# EAGLE design module (EAGLE 7.7.0)
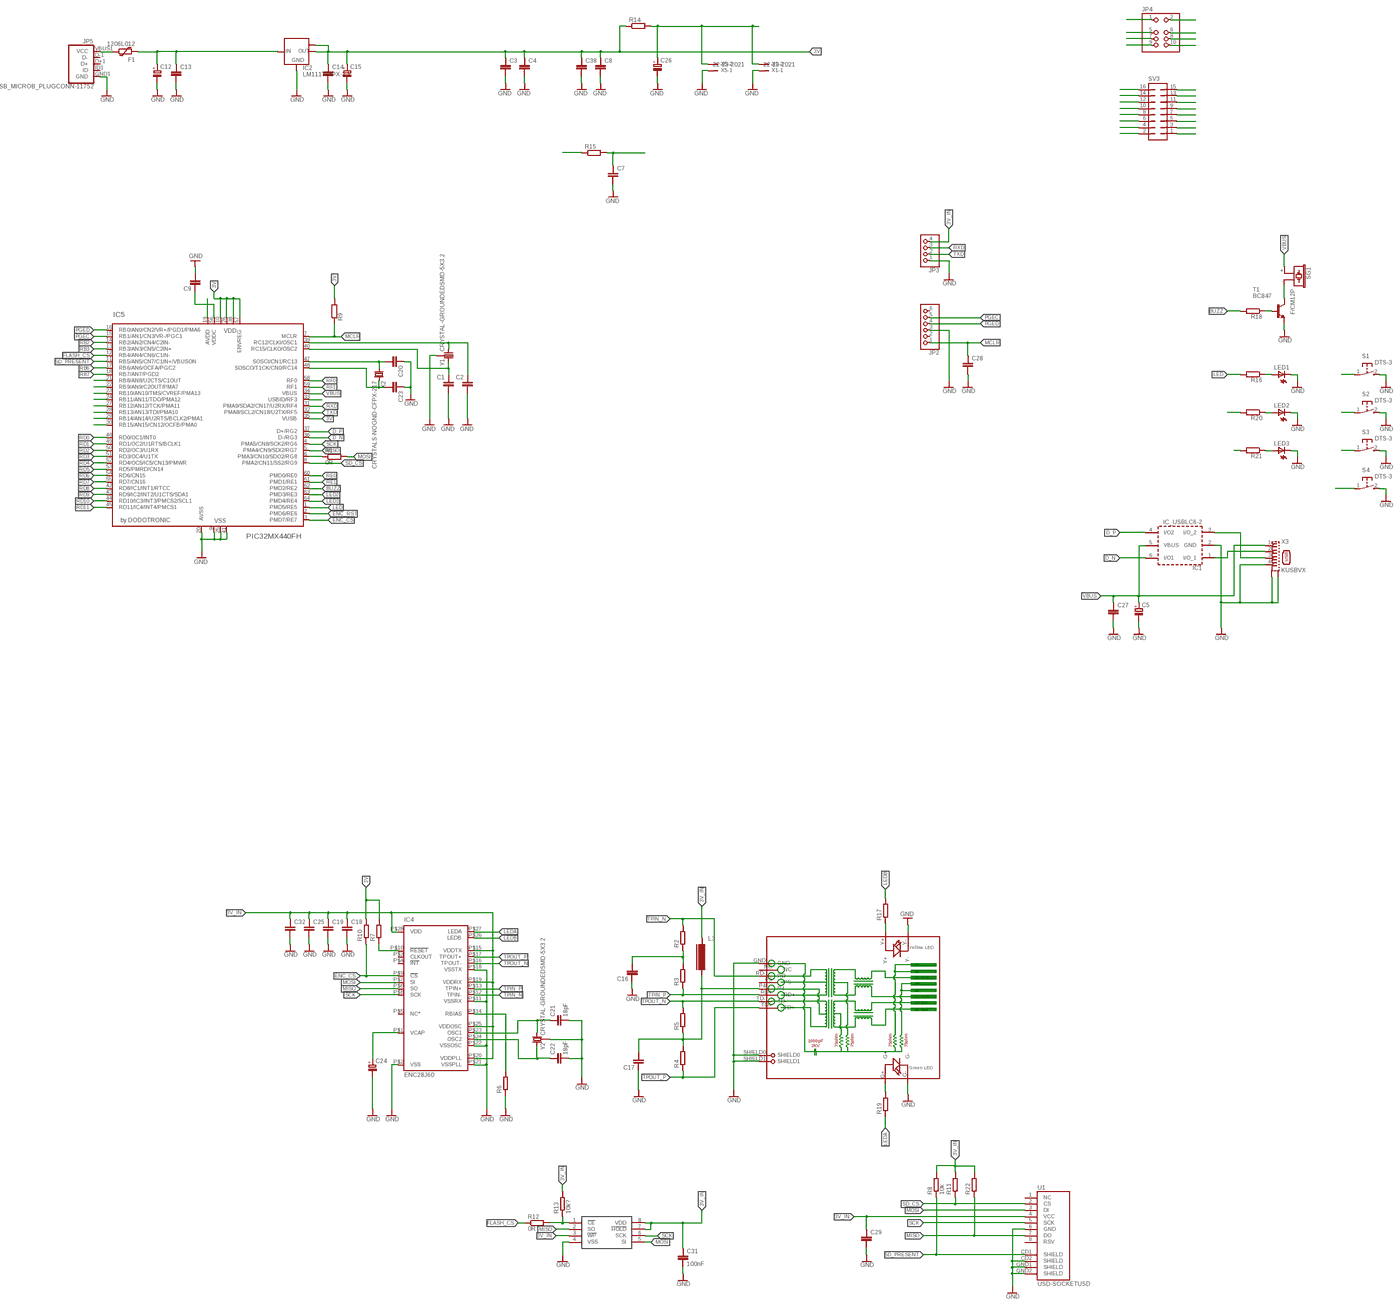
[diagram p0: schematic, sheet 1, overview]
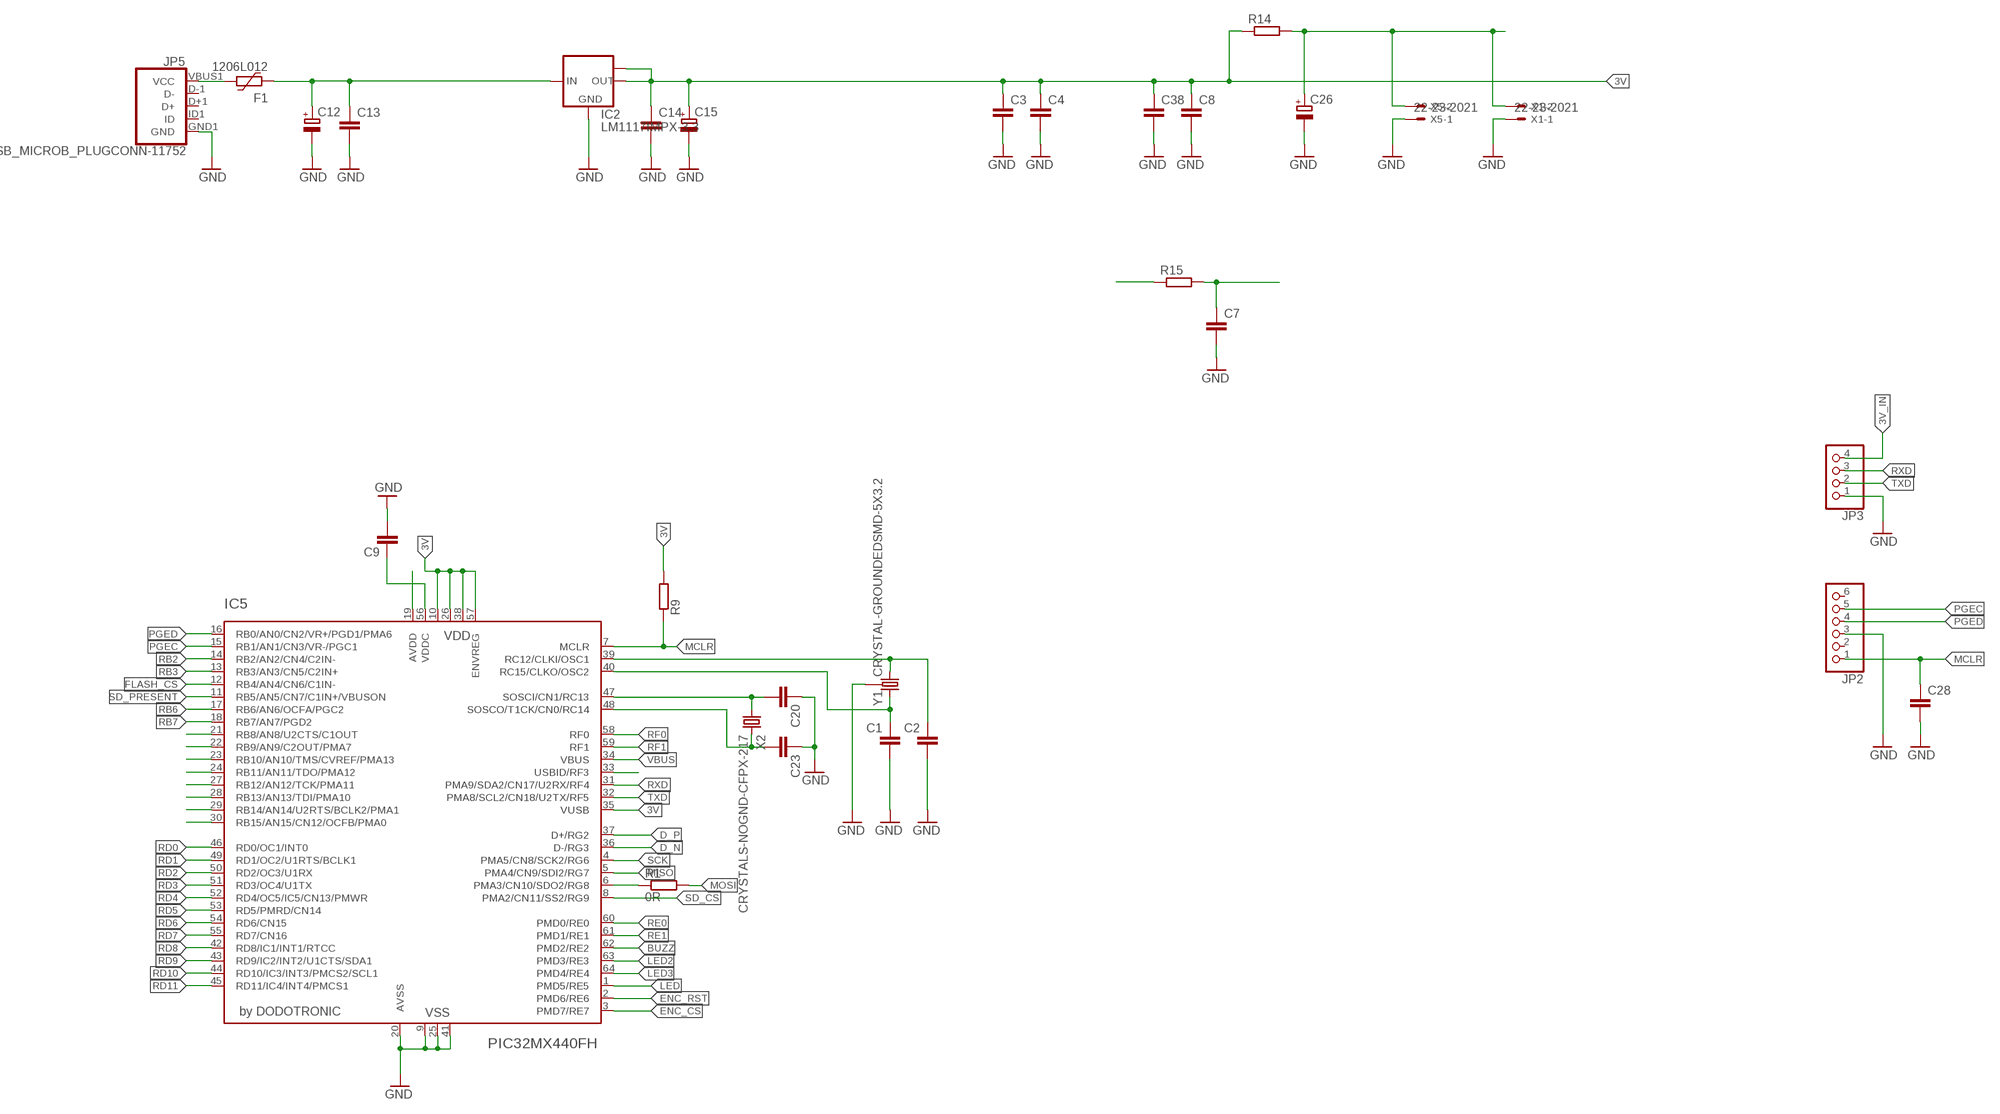
[diagram p1: schematic, sheet 1, part 1 of 4]
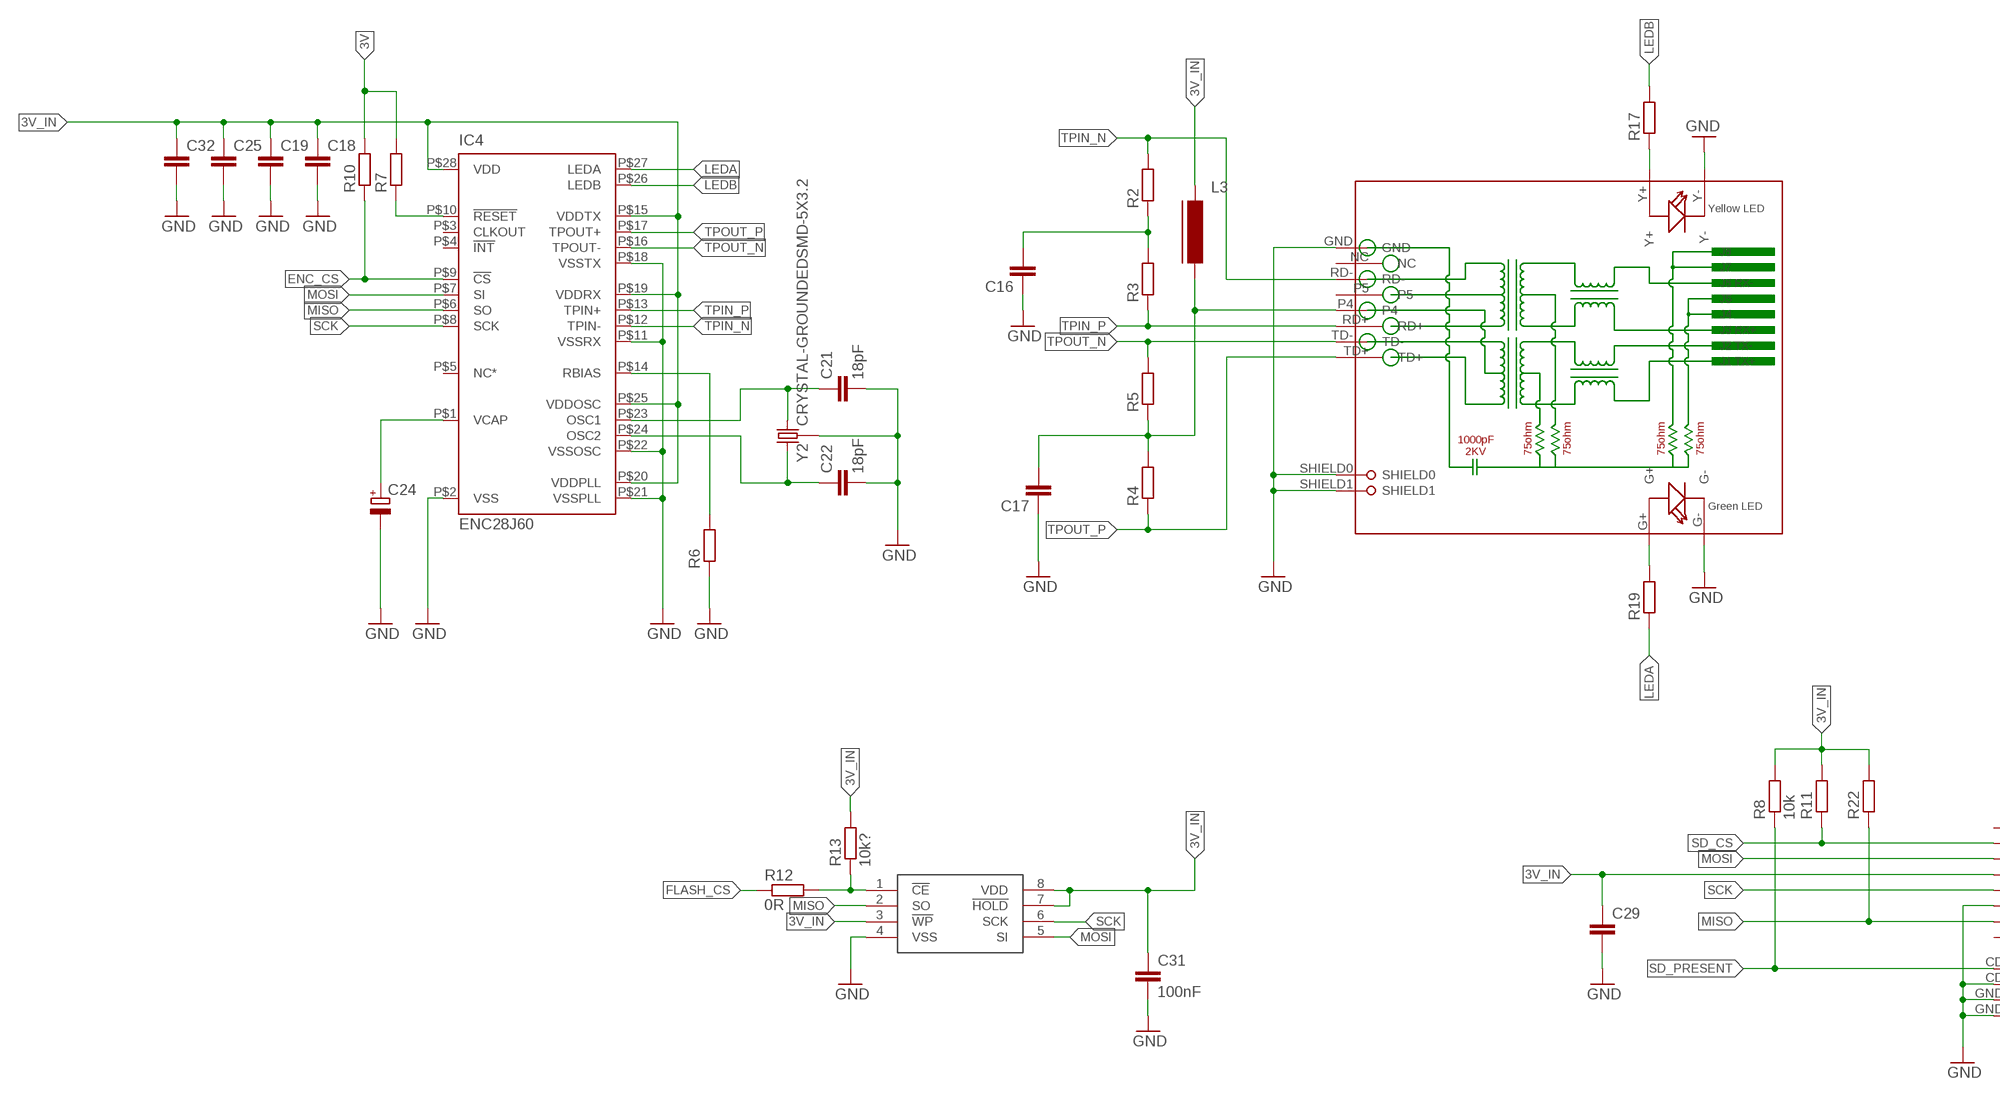
[diagram p2: schematic, sheet 1, part 2 of 4]
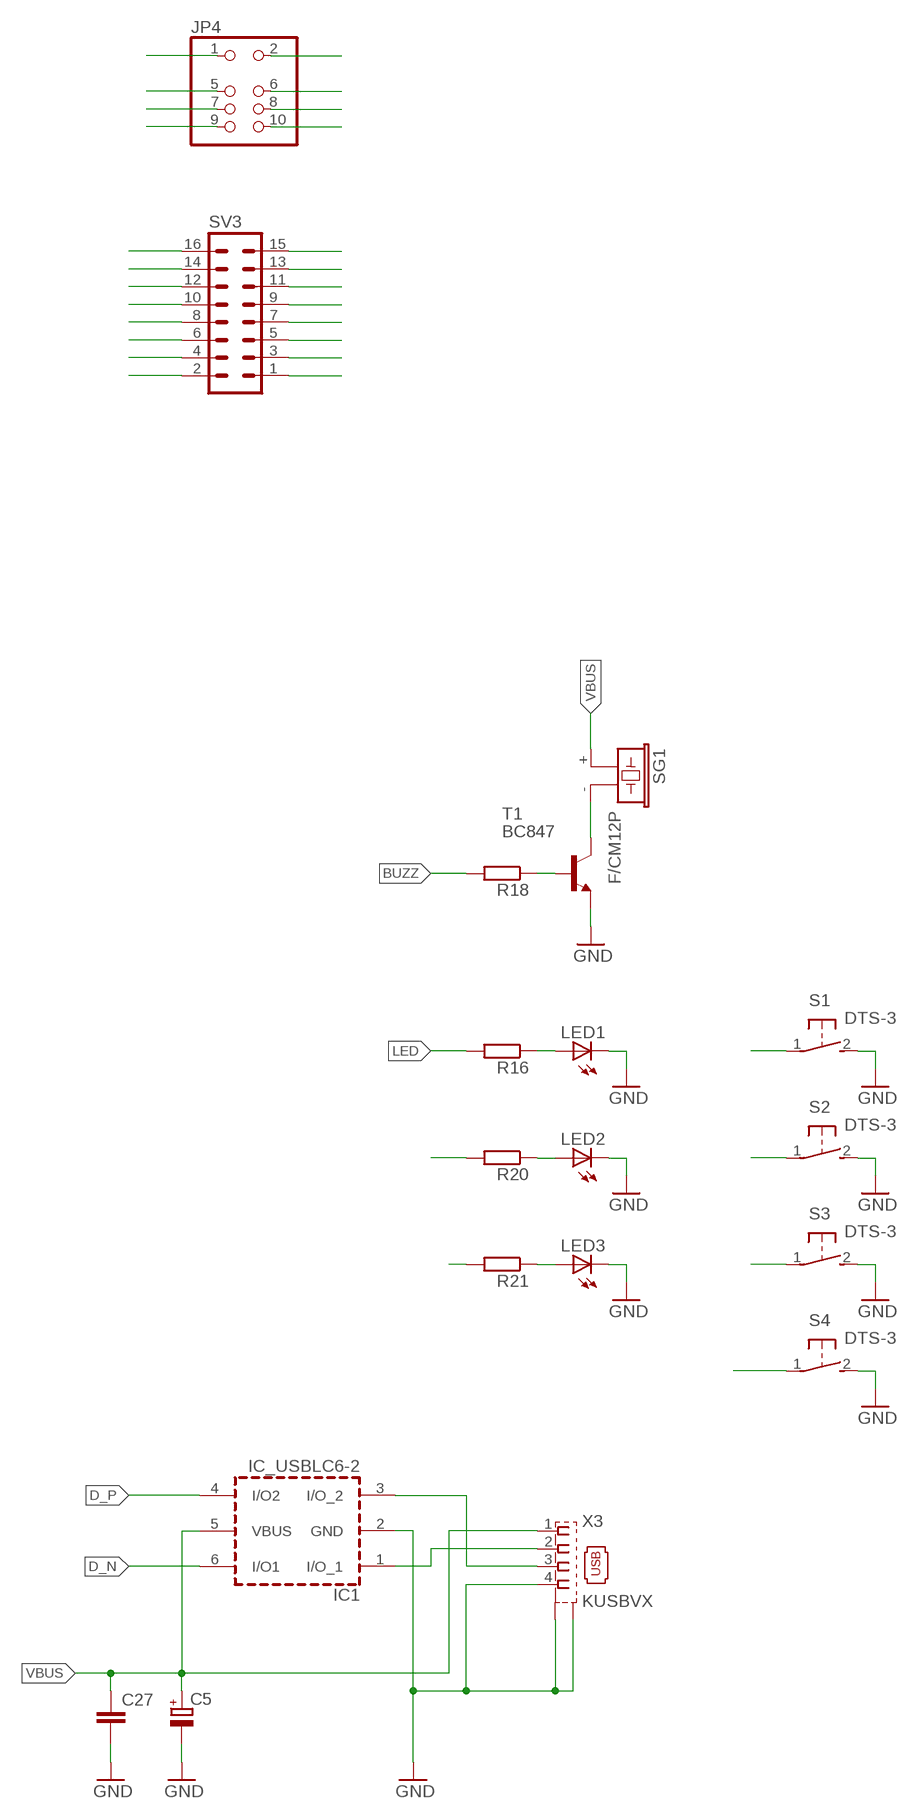
[diagram p3: schematic, sheet 1, part 3 of 4]
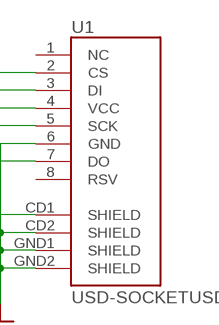
[diagram p4: schematic, sheet 1, part 4 of 4]

## Parts
C1  C-EUC0603  [C0603]
C2  C-EUC0603  [C0603]
C3  C-EUC0402  [C0402]
C4  C-EUC0402  [C0402]
C5  CPOL-EUSMCA  [SMC_A]
C7  C-EUC0402  [C0402]
C8  C-EUC0402  [C0402]
C9  C-EUC0603  [C0603]
C12  CPOL-EUSMCB  [SMC_B]
C13  C-EUC0603  [C0603]
C14  C-EUC0603  [C0603]
C15  CPOL-EUSMCB  [SMC_B]
C16  C-EUC0603  [C0603]
C17  C-EUC0603  [C0603]
C18  C-EUC0402  [C0402]
C19  C-EUC0603  [C0603]
C20  C-EUC0603  [C0603]
C21  18pF  C-EUC0603  [C0603]
C22  18pF  C-EUC0603  [C0603]
C23  C-EUC0603  [C0603]
C24  CPOL-EUSMCA  [SMC_A]
C25  C-EUC0603  [C0603]
C26  CPOL-EUSMCA  [SMC_A]
C27  C-EUC0603  [C0603]
C28  C-EUC0603  [C0603]
C29  C-EUC0603  [C0603]
C31  100nF  C-EUC0603  [C0603]
C32  C-EUC0402  [C0402]
C38  C-EUC0603  [C0603]
F1  1206L012  [1206L]
IC1  IC_USBLC6-2  [SOT-23-6L]
IC2  LM1117IMPX-3.3  [SOT223]
IC4  ENC28J60  [TSSOP28W]
IC5  PIC32MX440FH  [TQFP64-10X10]
JP2  PINHD-1X6  [1X06]
JP3  PINHD-1X4  [1X04]
JP4  PINHD-2X5  [2X05]
JP5  USB_MICROB_PLUGCONN-11752  [USB-B-MICRO-SMD_V03]
L3  FERRITE-0805  [FB805]
LED1  LED3MM  [LED3MM]
LED2  LED3MM  [LED3MM]
LED3  LED3MM  [LED3MM]
R1  0R  R-EU_R0603  [R0603]
R2  R-EU_R0603  [R0603]
R3  R-EU_R0603  [R0603]
R4  R-EU_R0603  [R0603]
R5  R-EU_R0603  [R0603]
R6  R-EU_R0805  [R0805]
R7  R-EU_R0402  [R0402]
R8  10k  R-EU_R0603  [R0603]
R9  R-EU_R0603  [R0603]
R10  R-EU_R0603  [R0603]
R11  R-EU_R0603  [R0603]
R12  0R  R-EU_R0603  [R0603]
R13  10k?  R-EU_R0603  [R0603]
R14  R-EU_R2010  [R2010]
R15  R-EU_R0805  [R0805]
R16  R-EU_R0603  [R0603]
R17  R-EU_R1206  [R1206]
R18  R-EU_R0603  [R0603]
R19  R-EU_R1206  [R1206]
R20  R-EU_R0603  [R0603]
R21  R-EU_R0603  [R0603]
R22  R-EU_R0603  [R0603]
RJ1  HR911105A  [HR911105A]
S1  DTS-3  [DTS-3]
S2  DTS-3  [DTS-3]
S3  DTS-3  [DTS-3]
S4  DTS-3  [DTS-3]
SG1  F/CM12P  [F/CM12P]
SV3  ML16L  [ML16L]
T1  BC847  [SOT23]
U1  USD-SOCKETUSD  [USD-SOCKET-PP]
U$2  SST25VF016BSO8M  [SO-08M]
X1  22-23-2021  [22-23-2021]
X2  CRYSTALS-NOGND-CFPX-217  [3.2X1.5-2-PAD]
X3  KUSBVX  [KUSBVX]
X5  22-23-2021  [22-23-2021]
Y1  CRYSTAL-GROUNDEDSMD-5X3.2  [CRYSTAL-SMD-5X3.2-4PAD]
Y2  CRYSTAL-GROUNDEDSMD-5X3.2  [CRYSTAL-SMD-5X3.2-4PAD]

## Nets
3V: C3.1 C4.1 C8.1 C14.1 C15.+ C38.1 IC2.2(OUT) IC2.TAB(OUT1) IC5.10(VDD) IC5.26(VDD) IC5.35(VUSB) IC5.38(VDD) IC5.57(ENVREG) R7.2 R9.2 R10.2 R14.1
3V_IN: C18.1 C19.1 C25.1 C26.+ C29.1 C31.1 C32.1 IC4.P$15(VDDTX) IC4.P$19(VDDRX) IC4.P$20(VDDPLL) IC4.P$25(VDDOSC) IC4.P$28(VDD) JP3.4 L3.1 R8.2 R11.2 R13.2 R14.2 R15.1 R22.2 U1.4(VCC) U$2.3(!WP) U$2.7(!HOLD) U$2.8(VDD) X1.2 X5.2
AV_3V: C7.1 IC5.19(AVDD) R15.2
BUZZ: IC5.62(PMD2/RE2) R18.2
CE1: R12.2 R13.1 U$2.1(!CE)
D2_N: IC1.1(I/O_1) X3.2
D2_P: IC1.3(I/O_2) X3.3
D_N: IC1.6(I/O1) IC5.36(D-/RG3)
D_P: IC1.4(I/O2) IC5.37(D+/RG2)
ENC_CS: IC4.P$9(!CS) IC5.3(PMD7/RE7) R10.1
ENC_RST: IC4.P$10(!RESET) IC5.2(PMD6/RE6) R7.1
FLASH_CS: IC5.12(RB4/AN4/CN6/C1IN-) R12.1
GND: C1.2 C2.2 C3.2 C4.2 C5.- C7.2 C8.2 C9.2 C12.- C13.2 C14.2 C15.- C16.1 C17.1 C18.2 C19.2 C20.1 C21.2 C22.2 C23.1 C24.- C25.2 C26.- C27.2 C28.2 C29.2 C31.2 C32.2 C38.2 IC1.2(GND) IC2.1(GND) IC4.P$2(VSS) IC4.P$11(VSSRX) IC4.P$18(VSSTX) IC4.P$21(VSSPLL) IC4.P$22(VSSOSC) IC5.9(VSS) IC5.20(AVSS) IC5.25(VSS) IC5.41(VSS) JP2.3 JP3.1 JP5.GND1(GND) LED1.K(C) LED2.K(C) LED3.K(C) R6.1 RJ1.G- RJ1.GND RJ1.SHIELD0 RJ1.SHIELD1 RJ1.Y- S1.2 S2.2 S3.2 S4.2 T1.2(E) U1.6(GND) U1.CD2(SHIELD) U1.GND1(SHIELD) U1.GND2(SHIELD) U$2.4(VSS) X1.1 X3.4 X3.M1(S1) X3.M2(S2) X5.1 Y1.2 Y1.4 Y2.2 Y2.4
LED: IC5.1(PMD5/RE5) R16.2
LED2: IC5.63(PMD3/RE3) R20.2
LED3: IC5.64(PMD4/RE4) R21.2
LEDA: IC4.P$27(LEDA) R19.1
LEDB: IC4.P$26(LEDB) R17.2
MCLR: C28.1 IC5.7(MCLR) JP2.1 R9.1
MISO: IC4.P$6(SO) IC5.5(PMA4/CN9/SDI2/RG7) R22.1 U1.7(DO) U$2.2(SO)
MOSI: IC4.P$7(SI) R1.2 U1.3(DI) U$2.5(SI)
N$1: SG1.- T1.3(C)
N$2: C16.2 R2.1 R3.2
N$3: R18.1 T1.1(B)
N$4: LED1.A R16.1
N$5: IC5.6(PMA3/CN10/SDO2/RG8) R1.1
N$6: C17.2 L3.2 R4.2 R5.1 RJ1.P4
N$7: LED2.A R20.1
N$12: IC4.P$14(RBIAS) R6.2
N$13: LED3.A R21.1
N$14: IC5.21(RB8/AN8/U2CTS/C1OUT) JP4.9
N$15: IC5.22(RB9/AN9/C2OUT/PMA7) JP4.10
N$16: IC5.23(RB10/AN10/TMS/CVREF/PMA13) JP4.7
N$17: F1.1 JP5.VBUS1(VCC)
N$18: IC5.24(RB11/AN11/TDO/PMA12) JP4.8
N$19: IC5.27(RB12/AN12/TCK/PMA11)
N$20: IC5.28(RB13/AN13/TDI/PMA10) JP4.5
N$21: IC5.29(RB14/AN14/U2RTS/BCLK2/PMA1) JP4.6
N$22: C21.1 IC4.P$23(OSC1) Y2.1
N$23: C22.1 IC4.P$24(OSC2) Y2.3
N$24: IC5.30(RB15/AN15/CN12/OCFB/PMA0) JP4.1
N$25: IC5.33(USBID/RF3) JP4.2
N$29: C24.+ IC4.P$1(VCAP)
N$30: R17.1 RJ1.Y+
N$31: R19.2 RJ1.G+
OSC1: C2.1 IC5.39(RC12/CLKI/OSC1) Y1.1
OSC2: C1.1 IC5.40(RC15/CLKO/OSC2) Y1.3
PGEC: IC5.15(RB1/AN1/CN3/VR-/PGC1) JP2.5
PGED: IC5.16(RB0/AN0/CN2/VR+/PGD1/PMA6) JP2.4
RB2: IC5.14(RB2/AN2/CN4/C2IN-) S2.1
RB3: IC5.13(RB3/AN3/CN5/C2IN+) S1.1
RB6: IC5.17(RB6/AN6/OCFA/PGC2) S3.1
RB7: IC5.18(RB7/AN7/PGD2) S4.1
RD0: IC5.46(RD0/OC1/INT0) SV3.6
RD1: IC5.49(RD1/OC2/U1RTS/BCLK1) SV3.5
RD2: IC5.50(RD2/OC3/U1RX) SV3.8
RD3: IC5.51(RD3/OC4/U1TX) SV3.7
RD4: IC5.52(RD4/OC5/IC5/CN13/PMWR) SV3.10
RD5: IC5.53(RD5/PMRD/CN14) SV3.9
RD6: IC5.54(RD6/CN15) SV3.12
RD7: IC5.55(RD7/CN16) SV3.11
RD8: IC5.42(RD8/IC1/INT1/RTCC) SV3.2
RD9: IC5.43(RD9/IC2/INT2/U1CTS/SDA1) SV3.1
RD10: IC5.44(RD10/IC3/INT3/PMCS2/SCL1) SV3.4
RD11: IC5.45(RD11/IC4/INT4/PMCS1) SV3.3
RE0: IC5.60(PMD0/RE0) SV3.16
RE1: IC5.61(PMD1/RE1) SV3.15
RF0: IC5.58(RF0) SV3.14
RF1: IC5.59(RF1) SV3.13
RXD: IC5.31(PMA9/SDA2/CN17/U2RX/RF4) JP3.3
SCK: IC4.P$8(SCK) IC5.4(PMA5/CN8/SCK2/RG6) U1.5(SCK) U$2.6(SCK)
SD_CS: IC5.8(PMA2/CN11/SS2/RG9) R11.1 U1.2(CS)
SD_PRESENT: IC5.11(RB5/AN5/CN7/C1IN+/VBUSON) R8.1 U1.CD1(SHIELD)
SOSCI: C20.2 IC5.47(SOSCI/CN1/RC13) X2.1
SOSCO: C23.2 IC5.48(SOSCO/T1CK/CN0/RC14) X2.2
TPIN_N: IC4.P$12(TPIN-) R2.2 RJ1.RD-
TPIN_P: IC4.P$13(TPIN+) R3.1 RJ1.RD+
TPOUT_N: IC4.P$16(TPOUT-) R5.2 RJ1.TD-
TPOUT_P: IC4.P$17(TPOUT+) R4.1 RJ1.TD+
TXD: IC5.32(PMA8/SCL2/CN18/U2TX/RF5) JP3.2
VBUS: C5.+ C12.+ C13.1 C27.1 F1.2 IC1.5(VBUS) IC2.3(IN) IC5.34(VBUS) SG1.+ X3.1
VCAP: C9.1 IC5.56(VDDC)
Unconnected: IC4.P$3(CLKOUT) IC4.P$4(!INT) IC4.P$5(NC*) JP2.2 JP2.6 JP5.D+1(D+) JP5.D-1(D-) JP5.ID1(ID) RJ1.NC RJ1.P5 U1.1(NC) U1.8(RSV)

## Library data of the parts
C1-C4 C7-C9 C13 C14 C16-C23 C25 C27-C29 C31 C32 C38 = rcl:C-EU: CAPACITOR, European symbol
C5 C12 C15 C24 C26 = rcl:CPOL-EU: POLARIZED CAPACITOR, European symbol
F1 = polyfuse-smd_10:?: Polyfuse Resettable PTC Source: http://www.littelfuse.com/products/resettable-ptcs.aspx; MF: Littelfuse; MPN: 1206L012; OC_FARNELL: 1596988; OC_NEWARK: 05M2298
IC1 = dp_devices:IC_USBLC6-2
IC2 = lm1117:LM1117IMPX-*
IC4 = microchip:ENC28J60: Stand-Alone Ethernet Controller with SPI Interface Source: http://ww1.microchip.com/downloads/en/DeviceDoc/39662c.pdf
IC5 = DodoMicroR3:PIC32MX440F*H: Microchip PIC32 USB
JP2 = pinhead:PINHD-1X6: PIN HEADER
JP3 = pinhead:PINHD-1X4: PIN HEADER
JP4 = mw:PINHD-2X5: PIN HEADER
JP5 = SparkFun-Connectors:USB_MICROB_PLUG: USB Micro-B connectors Some male, some female. Watch your step!; PROD_ID: CONN-11752
L3 = dp_devices:FERRITE: Ferrite bead in various packages
LED1-LED3 = led:LED: LED OSRAM: - CHIPLED LG R971, LG N971, LY N971, LG Q971, LY Q971, LO R971, LY R971 LH N974, LH R974 LS Q976, LO Q976, LY Q976 LO Q996 - Hyper CHIPLED LW Q18S LB Q993, LB Q99A, LB R99A - SideLED LS A670, LO A670, LY A670, LG A670, LP A670 LB A673, LV A673, LT A673, LW A673 LH A674 LY A675 LS A676, LA A676, LO A676, LY A676, LW A676 LS A679, LY A679, LG A679 - Hyper Micro SIDELED® LS Y876, LA Y876, LO Y876, LY Y876 LT Y87S - SmartLED LW L88C, LW L88S LB L89C, LB L89S, LG L890 LS L89K, LO L89K, LY L89K LS L896, LA L896, LO L896, LY L896 - TOPLED LS T670, LO T670, LY T670, LG T670, LP T670 LSG T670, LSP T670, LSY T670, LOP T670, LYG T670 LG T671, LOG T671, LSG T671 LB T673, LV T673, LT T673, LW T673 LH T674 LS T676, LA T676, LO T676, LY T676, LB T676, LH T676, LSB T676, LW T676 LB T67C, LV T67C, LT T67C, LS T67K, LO T67K, LY T67K, LW E67C LS E67B, LA E67B, LO E67B, LY E67B, LB E67C, LV E67C, LT E67C LW T67C LS T679, LY T679, LG T679 LS T770, LO T770, LY T770, LG T770, LP T770 LB T773, LV T773, LT T773, LW T773 LH T774 LS E675, LA E675, LY E675, LS T675 LS T776, LA T776, LO T776, LY T776, LB T776 LHGB T686 LT T68C, LB T68C - Hyper Mini TOPLED® LB M676 - Mini TOPLED Santana® LG M470 LS M47K, LO M47K, LY M47K Source: http://www.osram.convergy.de LUXEON: - LUMILED® LXK2-PW12-R00, LXK2-PW12-S00, LXK2-PW14-U00, LXK2-PW14-V00 LXK2-PM12-R00, LXK2-PM12-S00, LXK2-PM14-U00 LXK2-PE12-Q00, LXK2-PE12-R00, LXK2-PE12-S00, LXK2-PE14-T00, LXK2-PE14-U00 LXK2-PB12-K00, LXK2-PB12-L00, LXK2-PB12-M00, LXK2-PB14-N00, LXK2-PB14-P00, LXK2-PB14-Q00 LXK2-PR12-L00, LXK2-PR12-M00, LXK2-PR14-Q00, LXK2-PR14-R00 LXK2-PD12-Q00, LXK2-PD12-R00, LXK2-PD12-S00 LXK2-PH12-R00, LXK2-PH12-S00 LXK2-PL12-P00, LXK2-PL12-Q00, LXK2-PL12-R00 Source: www.luxeon.com KINGBRIGHT: KA-3528ASYC Source: www.kingbright.com
R1-R22 = rcl:R-EU_: RESISTOR, European symbol
RJ1 = hanrun:HR911105A
S1-S4 = switch-tact:DTS-3
SG1 = buzzer:F/CM12P: BUZZER Source: Buerklin; OC_FARNELL: unknown; OC_NEWARK: unknown
SV3 = con-harting-ml:ML16: HARTING; OC_FARNELL: unknown; OC_NEWARK: unknown
T1 = transistor:BC847: NPN TRANSISTOR
U1 = SparkFun-Connectors:USD-SOCKET: microSD Socket Push-push type uSD socket. Schematic element and footprint production proven. Spark Fun Electronics SKU : PRT-00127. tDoc lines correctly indicate media card edge positions when inserting (unlocked, locked, depressed).
U$2 = mw:SST25VF016B
X1 X5 = con-molex:22-23-2021: .100" (2.54mm) Center Header - 2 Pin; MF: MOLEX; MPN: 22-23-2021; OC_FARNELL: 1462926; OC_NEWARK: 25C3832
X2 = IQD-Frequency-Products:CRYSTALS-NOGND: CRYSTALS CAN NOT GROUNDED
X3 = con-kycon:KUSBVX: Vertical,Top Entry Universal Serial Bus Connector KUSBVX Series Source: KYCON Sibalco USB vertical socket KUSBV.pdf
Y1 Y2 = SparkFun-Clocks:CRYSTAL-GROUNDED: Crystals w/ Ground Pin (Generic) These are passive quartz crystals, which can be used as a clock source for a microcontroller. Crystal's are usually two-terminal devices. A third terminal may be optionally connected to ground, as recommended by the manufaturer.

## Board
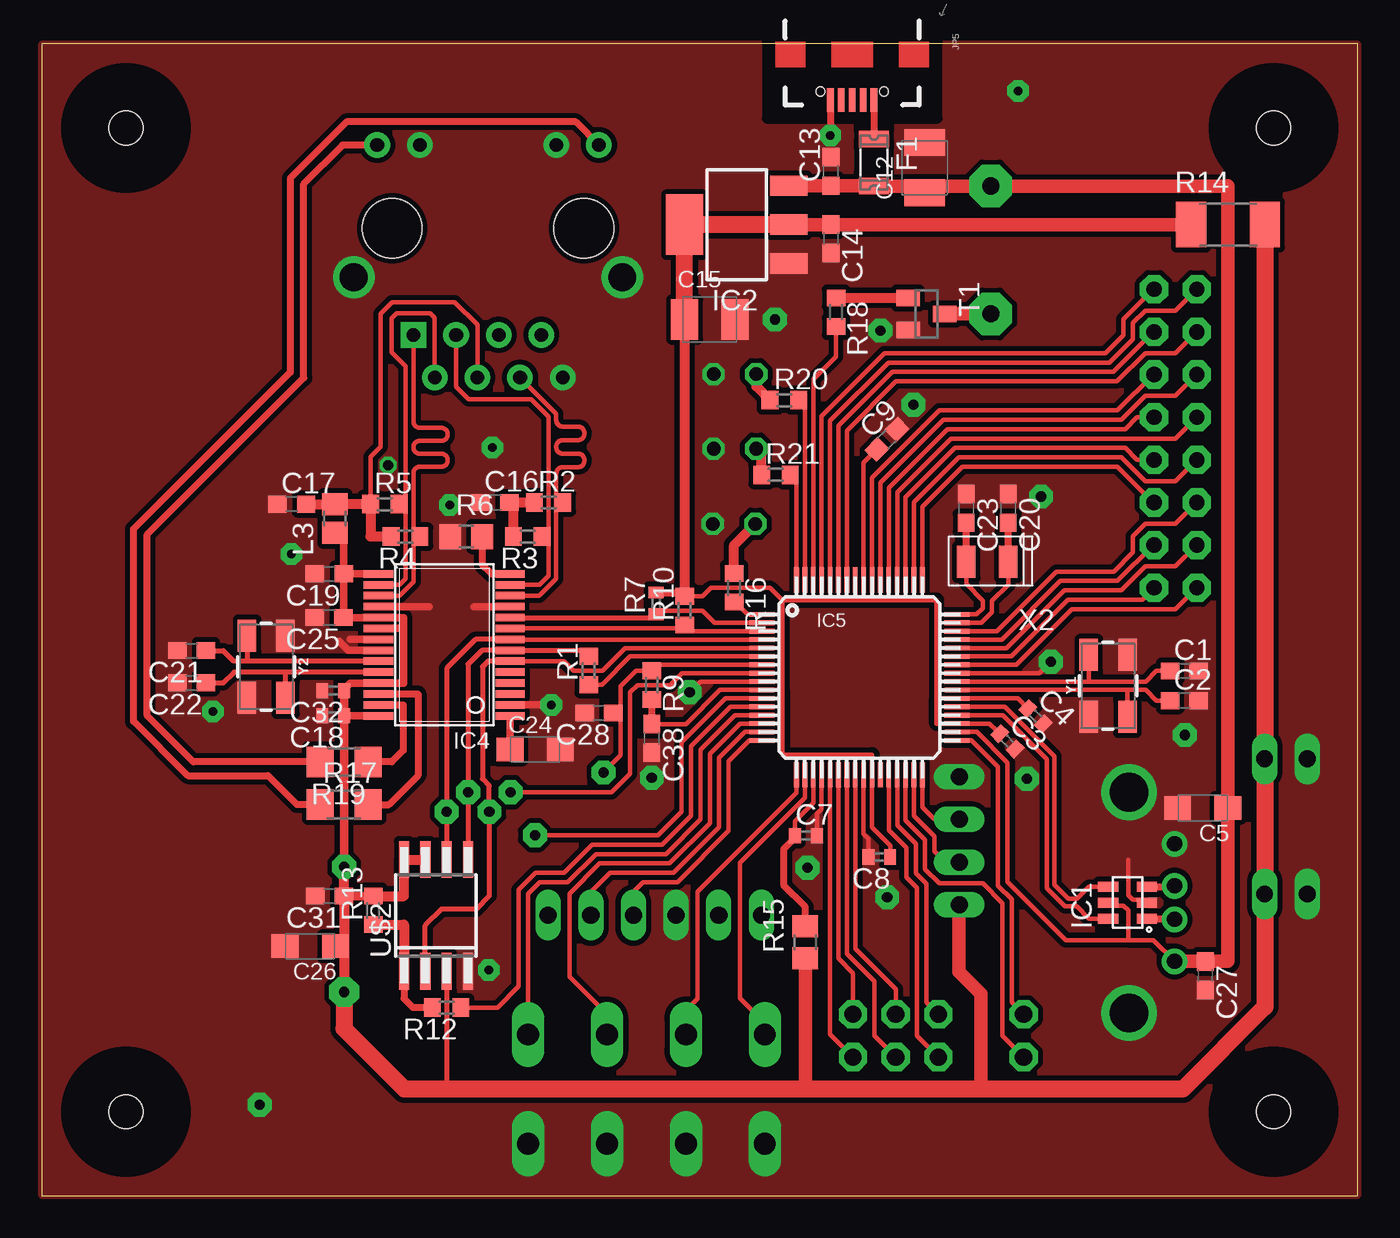
[diagram p5: board, top side]
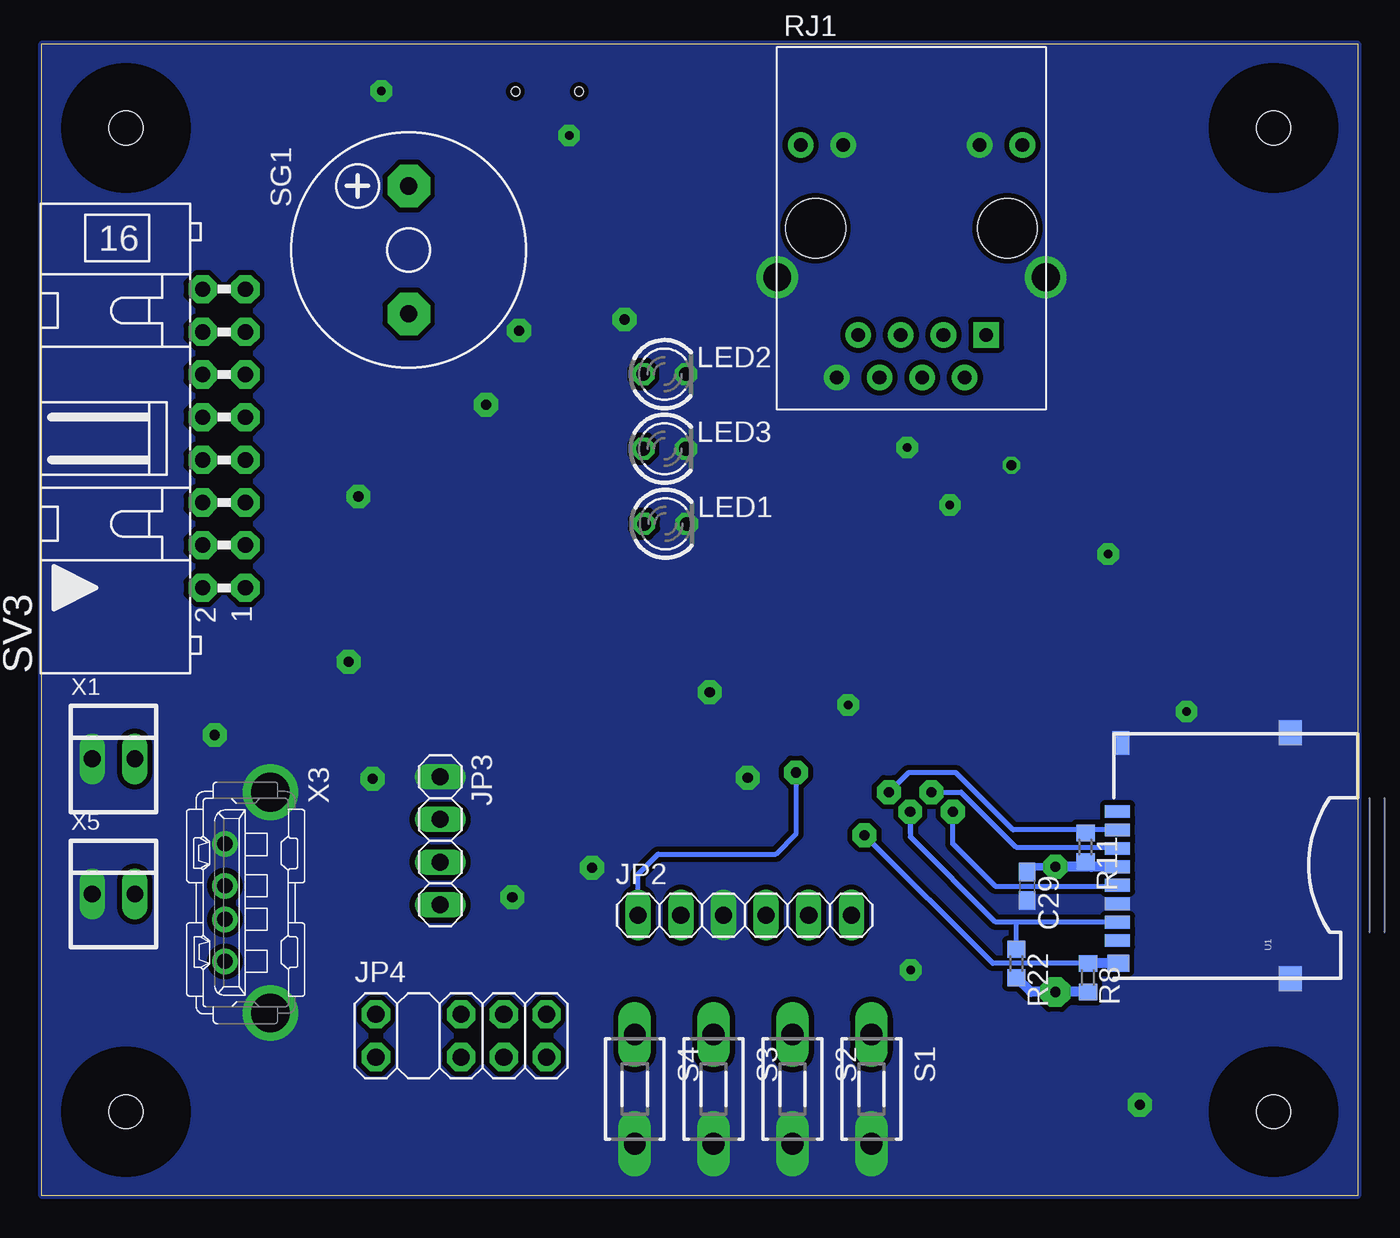
[diagram p6: board, bottom side, seen from below]

Size 78.36 x 68.58 mm. Coordinates in mm from the lower left corner, seen from the top.
Outline: 0,0 78.36,0 78.36,68.58 0,68.58 0,0
Copper layers (1*16): Top 0.035mm / dielectric 1.5mm / Bottom 0.035mm
Design rules "default *": minimum track width 10mil, minimum drill 24mil, track to track 8mil, track to pad 8mil, pad to pad 8mil, via to via 8mil, smd to smd 8mil, copper to edge 0mil, drill to drill 8mil, minimum pad ring 10mil, minimum via ring 8mil, stop-mask expansion 4mil, vias tented up to drill 0mil, thermal gap 10mil
Holes 2 mm at 5,5 73.36,5 73.36,63.58 5,63.58
tRestrict: area 63.7,16.2 to 65.6,18.7; area 19.1,28.3 to 20.9,37.3; area 27,28.3 to 28.8,37.3; area 48.7,61 to 50.5,62.8; area 43.2,64.1 to 53.3,68.6; area 1.4,1.4 to 8.6,8.6; area 69.8,1.4 to 76.9,8.6; area 69.8,60 to 76.9,67.1; area 1.4,60 to 8.6,67.1; area 43.4,58.4 to 50.8,59.7
bRestrict: area 1.4,1.4 to 8.6,8.6; area 69.8,1.4 to 76.9,8.6; area 69.8,60 to 76.9,67.1; area 1.4,60 to 8.6,67.1

### Footprints (pad centres in the part's own frame; a part is rotated, then mirrored left to right if it is on the bottom)
C0603 = smd 1.1 x 1: 1 -0.85,0; 2 0.85,0
C0402 = smd 0.7 x 0.9: 1 -0.65,0; 2 0.65,0
SMC_A = smd 1.6 x 1.4: + -1.5,0; - 1.5,0
SMC_B = smd 1.6 x 2.4: + -1.5,0; - 1.5,0
1206L = smd 1 x 1.8: 1 -1.4,0; 2 1.4,0
SOT-23-6L = smd 0.6 x 1.2: 1 -0.95,-2.3; 2 0,-2.3; 3 0.95,-2.3; 4 0.95,0; 5 0,0; 6 -0.95,0
SOT223 = smd 1.219 x 2.235: 1 -2.311,-3.099; 2 0,-3.099; 3 2.311,-3.099 | smd 3.6 x 2.2: TAB 0,3.099
TSSOP28W = smd 0.45 x 1.75: P$1 0,-0.65; P$2 0.65,-0.65; P$3 1.3,-0.65; P$4 1.95,-0.65; P$5 2.6,-0.65; P$6 3.25,-0.65; P$7 3.9,-0.65; P$8 4.55,-0.65; P$9 5.2,-0.65; P$10 5.85,-0.65; P$11 6.5,-0.65; P$12 7.15,-0.65; P$13 7.8,-0.65; P$14 8.45,-0.65; P$15 8.45,7.2; P$16 7.8,7.2; P$17 7.15,7.2; P$18 6.5,7.2; P$19 5.85,7.2; P$20 5.2,7.2; P$21 4.55,7.2; P$22 3.9,7.2; P$23 3.25,7.2; P$24 2.6,7.2; P$25 1.95,7.2; P$26 1.3,7.2; P$27 0.65,7.2; P$28 0,7.2
TQFP64-10X10 = smd 1.5 x 0.28: 1 -5.8,3.75; 2 -5.8,3.25; 3 -5.8,2.75; 4 -5.8,2.25; 5 -5.8,1.75; 6 -5.8,1.25; 7 -5.8,0.75; 8 -5.8,0.25; 9 -5.8,-0.25; 10 -5.8,-0.75; 11 -5.8,-1.25; 12 -5.8,-1.75; 13 -5.8,-2.25; 14 -5.8,-2.75; 15 -5.8,-3.25; 16 -5.8,-3.75; 33 5.8,-3.75; 34 5.8,-3.25; 35 5.8,-2.75; 36 5.8,-2.25; 37 5.8,-1.75; 38 5.8,-1.25; 39 5.8,-0.75; 40 5.8,-0.25; 41 5.8,0.25; 42 5.8,0.75; 43 5.8,1.25; 44 5.8,1.75; 45 5.8,2.25; 46 5.8,2.75; 47 5.8,3.25; 48 5.8,3.75 | smd 0.28 x 1.5: 17 -3.75,-5.8; 18 -3.25,-5.8; 19 -2.75,-5.8; 20 -2.25,-5.8; 21 -1.75,-5.8; 22 -1.25,-5.8; 23 -0.75,-5.8; 24 -0.25,-5.8; 25 0.25,-5.8; 26 0.75,-5.8; 27 1.25,-5.8; 28 1.75,-5.8; 29 2.25,-5.8; 30 2.75,-5.8; 31 3.25,-5.8; 32 3.75,-5.8; 49 3.75,5.8; 50 3.25,5.8; 51 2.75,5.8; 52 2.25,5.8; 53 1.75,5.8; 54 1.25,5.8; 55 0.75,5.8; 56 0.25,5.8; 57 -0.25,5.8; 58 -0.75,5.8; 59 -1.25,5.8; 60 -1.75,5.8; 61 -2.25,5.8; 62 -2.75,5.8; 63 -3.25,5.8; 64 -3.75,5.8
1X06 = drill 1.016 long: 1 -6.35,0; 2 -3.81,0; 3 -1.27,0; 4 1.27,0; 5 3.81,0; 6 6.35,0
1X04 = drill 1.016 long: 1 -3.81,0; 2 -1.27,0; 3 1.27,0; 4 3.81,0
2X05 = drill 1.016 pad 1.676 octagon: 1 -5.08,-1.27; 2 -5.08,1.27; 5 0,-1.27; 6 0,1.27; 7 2.54,-1.27; 8 2.54,1.27; 9 5.08,-1.27; 10 5.08,1.27
USB-B-MICRO-SMD_V03 = smd 1.4 x 0.4: D+1 2.7,0; D-1 2.7,0.65; GND1 2.7,-1.3; ID1 2.7,-0.65; VBUS1 2.7,1.3 | hole 0.5: 2.2,1.9; 2.2,-1.9
FB805 = smd 1.3 x 1.5: 1 -0.85,0; 2 0.85,0
LED3MM = drill 0.813 octagon: A -1.27,0; K 1.27,0
R0603 = smd 1 x 1.1: 1 -0.85,0; 2 0.85,0
R0805 = smd 1.3 x 1.5: 1 -0.95,0; 2 0.95,0
R0402 = smd 0.7 x 0.9: 1 -0.65,0; 2 0.65,0
R2010 = smd 1.8 x 2.7: 1 -2.2,0; 2 2.2,0
R1206 = smd 1.6 x 1.803: 1 -1.422,0; 2 1.422,0
HR911105A = drill 0.813 pad 1.524: G+ 4.953,-6.604; G- 4.953,-4.064; GND -8.89,4.445; NC -6.35,3.175; P4 -8.89,-0.635; P5 -6.35,0.635; RD+ -6.35,-1.905; RD- -8.89,1.905; TD- -8.89,-3.175; Y+ 4.953,6.604; Y- 4.953,4.064 | drill 1.651 pad 2.159: SHIELD0 -2.921,8.001; SHIELD1 -2.921,-8.001 | drill 0.813 pad 1.524 square: TD+ -6.35,-4.445 | hole 3.556: 0,-5.715; 0,5.715
DTS-3 = drill 1.3 long: 1 -3.25,0; 2 3.25,0
F/CM12P = drill 1.016 pad 2.54 octagon: + 3.81,0; - -3.81,0
ML16L = drill 0.914 pad 1.676 octagon: 1 -8.89,-1.27; 2 -8.89,1.27; 3 -6.35,-1.27; 4 -6.35,1.27; 5 -3.81,-1.27; 6 -3.81,1.27; 7 -1.27,-1.27; 8 -1.27,1.27; 9 1.27,-1.27; 10 1.27,1.27; 11 3.81,-1.27; 12 3.81,1.27; 13 6.35,-1.27; 14 6.35,1.27; 15 8.89,-1.27; 16 8.89,1.27
SOT23 = smd 1 x 1.4: 1 -0.95,-1.1; 2 0.95,-1.1; 3 0,1.1
USD-SOCKET-PP = smd 0.75 x 1.5: 1 3.2,14.3; 2 2.1,14.3; 3 1,14.3; 4 -0.1,14.3; 5 -1.2,14.3; 6 -2.3,14.3; 7 -3.4,14.3; 8 -4.5,14.3 | smd 1 x 1.3: CD1 -5.85,14.25 | smd 1.4 x 1: CD2 7.275,14.1 | smd 1.5 x 1.35: GND1 -6.775,4; GND2 7.875,4
SO-08M = smd 0.6 x 2.2: 1 -1.905,-3.33; 2 -0.635,-3.33; 3 0.635,-3.33; 4 1.905,-3.33; 5 1.905,3.33; 6 0.635,3.33; 7 -0.635,3.33; 8 -1.905,3.33
22-23-2021 = drill 1 long: 1 -1.27,0; 2 1.27,0
3.2X1.5-2-PAD = smd 1.1 x 1.9: 1 -1.25,0; 2 1.25,0
KUSBVX = drill 0.9 pad 1.524: 1 3.5,0; 2 1,0; 3 -1,0; 4 -3.5,0 | drill 2.3 pad 2.8: M1 -6.57,2.71; M2 6.57,2.71
CRYSTAL-SMD-5X3.2-4PAD = smd 1.9 x 1.1: 1 -1.85,-1.15; 2 1.85,-1.15; 3 1.85,1.15; 4 -1.85,1.15

### Placement (x,y rotation side)
C1  68.05,31.25 0 top
C2  68.05,29.48 0 top
C3  57.51,27.05 315 top
C4  59.19,28.55 315 top
C5  69.14,23.09 180 top
C7  45.5,21.44 0 top
C8  49.88,20.17 180 top
C9  50.34,45.03 45 top
C12  52.58,61.21 90 top
C13  46.99,60.99 90 top
C14  46.99,56.97 270 top
C15  39.78,52.17 0 top
C16  26.97,41.27 0 top
C17  14.88,41.17 0 top
C18  17.35,28.57 180 top
C19  17.12,37.02 180 top
C20  57.55,40.92 270 top
C21  8.92,32.46 180 top
C22  8.92,30.54 180 top
C23  55.05,40.92 270 top
C24  29.37,26.58 0 top
C25  17.11,34.43 180 top
C26  15.98,14.86 180 top
C27  69.29,13.1 270 top
C28  33.19,28.74 180 top
C29  19.68,18.41 270 bottom
C31  17.14,17.84 180 top
C32  17.35,30.07 180 top
C38  36.32,27.23 270 top
F1  49.56,61.52 270 top
IC1  63.5,17.45 90 top
IC2  41.38,57.82 90 top
IC4  27.23,28.57 90 top
IC5  48.69,30.86 0 top
JP2  36.5,16.7 0 bottom
JP3  54.64,21.13 270 bottom
JP4  53.39,9.53 0 bottom
JP5  48.26,67.94 270 top
L3  17.44,40.32 90 top
LED1  41.22,40.01 0 bottom
LED2  41.27,48.92 0 bottom
LED3  41.27,44.48 0 bottom
R1  32.56,31.28 90 top
R2  30.18,41.27 0 top
R3  28.93,39.24 180 top
R4  21.65,39.24 180 top
R5  20.42,41.17 0 top
R6  25.27,39.24 0 top
R7  36.58,35.27 90 top
R8  16.05,12.98 270 bottom
R9  36.32,30.4 270 top
R10  38.28,34.83 90 top
R11  16.21,20.75 270 bottom
R12  24.1,11.2 180 top
R13  19.74,16.99 90 top
R14  70.64,57.82 0 top
R15  45.47,15.09 90 top
R16  41.22,36.2 270 top
R17  18,23.29 0 top
R18  47.29,52.6 270 top
R19  18,25.83 180 top
R20  44.22,47.37 0 top
R21  43.72,42.93 0 top
R22  20.32,13.83 270 bottom
RJ1  26.57,57.61 90 bottom
S1  28.96,6.35 270 bottom
S2  33.66,6.35 270 bottom
S3  38.35,6.35 270 bottom
S4  43.05,6.35 270 bottom
SG1  56.52,56.31 90 bottom
SV3  67.51,45.09 90 bottom
T1  52.68,52.5 270 top
U1  0,19.68 90 bottom
U$2  23.47,16.69 0 top
X1  74.09,26.01 0 bottom
X2  56.3,37.74 180 top
X3  67.46,17.45 270 bottom
X5  74.09,17.97 0 bottom
Y1  63.5,30.36 90 top
Y2  13.36,31.5 270 top

### Tracks (layer width: path | path; a pad name or v marks a point on that pad's centre or on a via)
3V
  Top 0.279: 56.88,27.67 C3.1 56.88,27.51 56.88,27.67 | 56.88,27.67 56.45,28.11 IC5.35 53.29,28.11 53.29,29.61 | 44.09,30.11 IC5.10 40.4,30.11 38.37,28.08 C38.1 | 44.09,30.11 44.09,35.46 | 44.09,35.46 48.49,35.46 | 48.49,35.46 53.29,35.46 53.29,29.61 | 53.29,29.61 IC5.38 58.12,29.61 C4.1 | 44.09,30.11 44.09,26.26 49.44,26.26 IC5.26 49.44,21.93 50.53,20.85 C8.1 | 44.09,35.46 43.36,36.2 39.85,36.2 39.34,35.69 R10.2 | IC5.57 48.44,35.51 48.49,35.46
  Top 0.305: 38.09,35.87 R10.2
  Top 0.406: C38.1 R9.2 | 38.09,35.87 36.63,35.87 R7.2
  Top 0.61: C15.+ R10.2 | IC2.TAB
  Top 0.813: IC2.2 C14.1 R14.1
  Top 1.016: IC2.2 IC2.TAB | C15.+ IC2.TAB
3V_IN  (via drill 0.6 pad 1.42, 0.6 pad 1.78)
  Top 0.305: U$2.3 24.11,6.38 24.13,6.35
  Top 0.406: 18,14.61 17.74,14.86 C26.+
  Top 0.457: L3.1 17.92,39 17.97,39 C19.1 | IC4.P$15 C19.1 | C19.1 C25.1 IC4.P$19 21.54,34.42 21.54,33.77 | C32.1 18,30.16 18.36,30.52 IC4.P$25 21.54,30.52 21.54,33.77 | IC4.P$28 C18.1 | IC4.P$20 21.54,33.77
  Top 0.508: C32.1 C18.1 v18,19.58 | R13.2 C31.1
  Top 0.61: U$2.7 U$2.8 21.57,17.84 R13.2 | v18,19.58 C31.1 18,14.61 v18,12.13 | 54.63,6.38 54.61,6.35 | X5.2 72.82,17.8 72.84,17.78 | X1.2 72.82,26.65 72.84,26.67 | 45.47,6.6 45.72,6.35
  Top 0.813: 55.88,6.35 55.93,6.4 55.93,12.01 54.61,13.34 54.61,17.3 JP3.4 | R15.1 45.47,6.6
  Top 1.016: v18,12.13 18,9.95 21.59,6.35 24.13,6.35 45.72,6.35 54.61,6.35 55.88,6.35 67.94,6.35 72.84,11.24 72.84,17.78 72.84,26.67 R14.2
  Bottom 0.406: R11.2 16.19,19.9 15.88,19.59
  Bottom 0.457: C29.1 19.37,19.58 v18,19.58
  Bottom 0.61: U1.4 15.88,19.59 v17.99,19.59 v18,19.58 | R8.2 v18,12.13 19.47,12.13 R22.2
AV_3V
  Top 0.279: IC5.19 45.94,23.39 44.85,22.3 C7.1
  Top 0.406: C7.1 44.85,21.31 44.17,20.62 44.17,18.49 45.47,17.2 R15.2
BUZZ
  Top 0.254: IC5.62 45.94,48.61 47.3,49.96 R18.2
CE1
  Top 0.406: R12.2 22.1,11.2 21.57,11.73 U$2.1
  Top 0.61: R13.1 21.57,16.14 U$2.1
D2_N
  Top 0.406: IC1.1 67.41,16.5 X3.2
D2_P
  Top 0.406: IC1.3 67.41,18.4 X3.3
D_N
  Top 0.254: IC1.6 62.37,16.5 61.65,17.22 60.94,17.22 59.84,18.32 59.84,25.99 57.22,28.61 IC5.36
D_P
  Top 0.254: IC1.4 62.37,18.4 61.65,17.68 61.13,17.68 60.3,18.51 60.3,26.18 57.37,29.11 IC5.37
ENC_CS
  Top 0.254: IC4.P$9 38.07,33.78 R10.1 38.65,33.61 IC5.3
ENC_RST
  Top 0.254: IC5.2 40.06,34.11 39.34,34.82 36.78,34.82 R7.1 36.58,34.57
  Top 0.305: IC4.P$10 36.38,34.42 R7.1
FLASH_CS
  Top 0.254: IC5.12 41,29.11 38.66,26.77 38.66,22.63 36.93,20.9 32.77,20.9 31.09,19.23 29.41,19.23 28.4,18.21 28.4,12.47 27.13,11.2 R12.1
GND  (via drill 0.5 pad 1.27, 0.6 pad 1.02, 0.6 pad 1.42)
  Top 0.254: IC1.2 65.8,17.62 64.97,17.62 64.69,17.9 64.69,19.99
  Top 0.279: IC5.9 39.22,30.61 v38.58,29.97 | IC5.41 59.4,31.11 v60.1,31.8 | IC5.20 46.44,23.02 46.15,22.73 C7.2 | IC5.25 48.94,21.54 49.23,21.26 C8.2
  Top 0.406: JP5.GND1 v46.96,63.13
  Top 0.457: IC4.P$11 25.73,35.08 | IC4.P$18 23.07,35.08 | IC4.P$21 18.36,33.12 | IC4.P$22 18.25,32.48 17.7,33.02 | IC4.P$2 30.46,29.23 30.48,29.21
  other vias: 12.96,5.41 58.67,24.82 68.07,27.43 20.62,43.48 14.86,38.2 24.28,41.12 26.82,44.55 30.34,29.23 26.61,13.44 58.14,65.79 10.19,28.83 59.51,41.63 36.32,24.89 51.92,47.09 43.66,52.17 49.94,51.51 45.59,19.53 50.34,17.78
  pour Top (isolate 0.305, no thermals): 0,0 0,68.58 78.36,68.58 78.36,0
  pour Bottom (isolate 0.305, no thermals): 0,68.58 0,0 78.36,0 78.36,68.58
LED
  Top 0.254: IC5.1 42.02,34.61 41.29,35.34 R16.2
LED2
  Top 0.254: IC5.63 45.44,47 R20.2
LED3
  Top 0.254: IC5.64 44.94,42.69 44.8,42.69 R21.2
LEDA
  Top 0.406: IC4.P$27 21.51,29.23 21.51,26.52 20.83,25.83 R19.1
LEDB
  Top 0.406: IC4.P$26 22.4,29.88 22.4,25.02 20.68,23.29 R17.2
MCLR  (via drill 0.6 pad 1.42)
  Top 0.254: R9.1 35.39,31.25 34.47,30.33 34.47,28.57 | 34.47,28.57 34.47,26.21 v33.45,25.2 | C28.1 34.3,28.74 34.47,28.57
  Top 0.279: IC5.7 36.67,31.61 R9.1
  Bottom 0.305: JP2.1 42.85,19.15 41.66,20.34 34.65,20.34 33.45,21.54 v33.45,25.2
MISO  (via drill 0.6 pad 1.42)
  Top 0.254: IC4.P$6 31.09,31.82 31.65,31.27 33.38,31.27 34.72,32.61 IC5.5
  Top 0.305: U$2.2 22.84,16.1 23.8,17.07 25.86,17.07 26.64,17.86 v26.64,22.86 26.64,24.41 26.24,24.82 26.24,31.5 26.57,31.83 26.57,31.82 IC4.P$6
  Bottom 0.305: U1.7 20.32,16.29 | 20.32,16.29 21.57,16.29 26.64,21.36 v26.64,22.86 26.64,21.59 | R22.1 20.32,16.29
MOSI  (via drill 0.6 pad 1.42)
  Top 0.305: U$2.5 v25.38,24.03 25.38,31.65 26.2,32.48 IC4.P$7 32.22,32.48 R1.2
  Bottom 0.305: v25.38,24.03 23.62,24.03 20.34,20.75 14.37,20.75 U1.3
N$1
  Top 0.813: T1.3 SG1.-
N$2
  Top 0.61: R3.2 28.08,41.09 28,41.09 C16.2 R2.1
N$3
  Top 0.61: R18.1 T1.1
N$4
  Top 0.61: R16.1 41.22,38.73 LED1.A
N$5
  Top 0.203: R1.1 32.62,30.43
  Top 0.254: 32.62,30.43 33.35,30.43 35.03,32.11 IC5.6
N$6
  Top 0.254: RJ1.P4 25.93,51.87 24.59,53.21 20.85,53.21 20.17,52.53 20.17,44.6 19.57,44.01 R5.1
  Top 0.61: R4.2 19.57,39.24 R5.1 L3.2 | L3.2 | C17.2 L3.2
N$7
  Top 0.61: LED2.A 42.55,48.2 R20.1
N$8  (via drill 0.6 pad 1.27)
  other vias: 73.36,5
N$9  (via drill 0.6 pad 1.27)
  other vias: 73.36,63.58
N$11  (via drill 0.6 pad 1.27)
  other vias: 5,63.58
N$12
  Top 0.406: IC4.P$14 26.78,37.02 26.22,37.58 R6.2
N$13
  Top 0.61: R21.1 42.87,44.15 LED3.A
N$14
  Top 0.254: IC5.21 46.94,9.62 JP4.9
N$15
  Top 0.254: IC5.22 47.44,14.13 48.31,13.26 JP4.10
N$16
  Top 0.254: IC5.23 47.94,14.41 49.58,12.78 49.58,9.53 JP4.7
N$17
  Top 0.406: JP5.VBUS1 F1.1
N$18
  Top 0.254: IC5.24 48.44,14.7 50.85,12.29 JP4.8
N$20
  Top 0.254: IC5.28 50.44,21.77 51.49,20.73 51.49,18.97 52.12,18.34 52.12,9.53 JP4.5
N$21
  Top 0.254: IC5.29 50.94,22.06 52.05,20.95 52.05,19.2 52.68,18.57 52.68,11.51 JP4.6
N$22
  Top 0.305: IC4.P$23 12.22,31.82 | 12.22,31.82 11.43,31.82 10.8,32.46 C21.1 | Y2.1 12.21,31.83 12.22,31.82
N$23
  Top 0.305: IC4.P$24 14.53,31.18 | 14.53,31.18 11.44,31.18 10.8,30.54 C22.1 | Y2.3 14.51,31.16 14.53,31.18
N$24
  Top 0.254: IC5.30 51.44,22.34 52.6,21.18 52.6,19.43 53.44,18.59 56.03,18.59 57.2,17.42 57.2,9.53 JP4.1
N$25
  Top 0.254: IC5.33 55.36,27.11 56.95,25.53 56.95,18.47 57.76,17.65 57.76,11.51 JP4.2
N$29
  Top 0.406: C24.+
  Top 0.457: IC4.P$1 C24.+
N$30
  Top 0.406: RJ1.Y+ 31.8,63.93 18.14,63.93 14.78,60.58 14.78,49.02 5.46,39.7 5.46,28.25 8.69,25.02 13.46,25.02 15.19,23.29 R17.1
N$31
  Top 0.406: R19.2 9.02,25.83 6.27,28.57 6.27,39.37 15.6,48.69 15.6,60.25 17.91,62.56 RJ1.G+
N$36  (via drill 0.6 pad 1.27)
  other vias: 5,5
OSC1
  Top 0.254: IC5.39 64.59,30.11 | 64.59,30.11 65.75,30.11 66.38,29.48 C2.1 | Y1.1 64.65,30.05 64.59,30.11
OSC2
  Top 0.254: IC5.40 62.33,30.61 | 62.33,30.61 65.75,30.61 66.38,31.25 C1.1 | Y1.3 62.35,30.63 62.33,30.61
PGEC
  Top 0.254: IC5.15 41.86,27.61 40.34,26.09 40.34,21.95 37.62,19.23 33.83,19.23 32.69,18.09 JP2.5
PGED
  Top 0.254: IC5.16 42.15,27.11 40.89,25.86 40.89,21.72 37.85,18.67 35.81,18.67 35.23,18.09 JP2.4
RB2
  Top 0.254: IC5.14 41.57,28.11 39.78,26.31 39.78,22.17 37.39,19.79 33.22,19.79 31.42,17.98 31.42,13.03 33.66,10.79 S2.1
RB3
  Top 0.254: IC5.13 41.29,28.61 39.22,26.54 39.22,22.4 37.16,20.34 32.99,20.34 31.32,18.67 29.64,18.67 28.96,17.98 S1.1
RB6
  Top 0.254: S3.1 38.35,11.05 39.04,11.73 39.04,18.09 44.94,23.99 IC5.17
RB7
  Top 0.254: IC5.18 45.44,23.7 41.58,19.84 41.58,11.76 43.05,10.29 S4.1
RD0
  Top 0.254: IC5.46 56.88,33.61 60.43,37.16 63.83,37.16 64.97,38.3 64.97,39.27 65.71,40.01 67.51,40.01 SV3.6
RD1
  Top 0.254: IC5.49 52.44,41.01 54.84,43.41 64.06,43.41 66.19,41.27 SV3.5
RD2
  Top 0.254: IC5.50 51.94,41.3 54.61,43.97 64.29,43.97 65.71,42.55 67.51,42.55 SV3.8
RD3
  Top 0.254: IC5.51 51.44,41.59 54.38,44.53 64.52,44.53 65.23,43.81 SV3.7
RD4
  Top 0.254: IC5.52 50.94,41.87 54.15,45.09 67.51,45.09 SV3.10
RD5
  Top 0.254: IC5.53 50.44,42.16 53.92,45.64 64.52,45.64 65.23,46.35 SV3.9
RD6
  Top 0.254: IC5.54 49.94,42.45 53.7,46.2 64.29,46.2 65.71,47.62 67.51,47.62 SV3.12
RD7
  Top 0.254: IC5.55 49.44,42.74 53.47,46.76 64.06,46.76 66.19,48.9 SV3.11
RD8
  Top 0.254: IC5.42 58.03,31.61 61.34,34.92 67.51,34.92 SV3.2
RD9
  Top 0.254: IC5.43 57.74,32.11 61.11,35.48 65.53,35.48 SV3.1
RD10
  Top 0.254: IC5.44 57.45,32.61 60.88,36.04 64.29,36.04 65.71,37.47 67.51,37.47 SV3.4
RD11
  Top 0.254: IC5.45 57.16,33.11 60.66,36.6 64.06,36.6 66.19,38.73 SV3.3
RE0
  Top 0.254: IC5.60 46.94,46.13 50.42,49.61 63.58,49.61 64.97,51 64.97,51.97 65.71,52.7 67.51,52.7 SV3.16
RE1
  Top 0.254: IC5.61 46.44,46.42 50.19,50.16 63.35,50.16 64.41,51.23 64.41,52.2 66.19,53.98 SV3.15
RF0
  Top 0.254: IC5.58 47.94,45.55 50.88,48.49 64.03,48.49 65.71,50.16 67.51,50.16 SV3.14
RF1
  Top 0.254: IC5.59 47.44,45.84 50.65,49.05 63.8,49.05 66.19,51.44 SV3.13
RXD
  Top 0.254: IC5.31 51.94,22.63 53.16,21.41 53.16,20.5 53.8,19.86 JP3.3
SCK  (via drill 0.6 pad 1.42)
  Top 0.254: IC5.4 27.89,33.11 IC4.P$8
  Top 0.305: IC4.P$8 25.84,33.12 24.11,31.39 v24.11,22.86 U$2.6
  Bottom 0.305: U1.5 14.37,18.41 21.57,18.41 24.11,20.95 v24.11,22.86
SD_CS  (via drill 0.6 pad 1.42)
  Top 0.254: IC5.8 38.12,31.11 37.41,30.4 35.46,30.4 35.03,29.97 35.03,25.12 33.93,24.03 v27.91,24.03
  Bottom 0.305: U1.2 15.88,21.79 20.52,21.79 23.93,25.2 26.75,25.2 v27.91,24.03
  Bottom 0.406: R11.1 16.06,21.6 15.88,21.79
SD_PRESENT  (via drill 0.6 pad 1.42)
  Top 0.254: IC5.11 40.71,29.61 38.1,27 38.1,22.86 36.7,21.46 v29.36,21.46
  Bottom 0.305: R8.1 21.73,13.83 v29.36,21.46
  Bottom 0.61: U1.CD1 R8.1
SOSCI
  Top 0.254: IC5.47 55.95,34.11 56.59,34.75 56.59,35.43 57.55,36.39 X2.1
  Top 0.406: X2.1 C20.2
SOSCO
  Top 0.254: IC5.48 55.67,34.61 56.04,34.98 56.04,35.43 55.05,36.42 X2.2
  Top 0.406: X2.2 C23.2
TPIN_N
  Top 0.254: IC4.P$12 29.62,35.73 30.63,36.73 30.63,41.3 | RJ1.RD- 30.63,46.56 30.63,46.18 arc90 31.01,45.8 31.93,45.8 arc-90 32.31,45.41 32.31,45.37 arc-90 31.93,44.99 31.01,44.99 arc90 30.63,44.61 30.63,44.56 arc90 31.01,44.18 31.93,44.18 arc-90 32.31,43.8 32.31,43.76 arc-90 31.93,43.38 31.01,43.38 arc90 30.63,42.99 30.63,41.3 | R2.2 30.66,41.27 30.63,41.3
TPIN_P
  Top 0.254: IC4.P$13 29.63,36.38 30.18,36.92 30.18,39.55 | 30.18,39.55 30.18,46.38 29.13,47.42 25.4,47.42 24.66,48.16 RJ1.RD+ | R3.1 29.87,39.24 30.18,39.55
TPOUT_N
  Top 0.254: R5.2 21.67,41.17 | 21.67,41.17 21.67,49.38 20.83,50.22 20.83,52.25 21.13,52.55 23.11,52.55 23.39,52.27 RJ1.TD- | 21.67,41.17 21.67,36.75 21.29,36.38 IC4.P$16
TPOUT_P
  Top 0.254: 22.12,39.14 22.12,36.56 21.29,35.73 IC4.P$17 | R4.1 22.12,39.14 | 22.12,39.14 22.12,43.02 arc-90 22.5,43.41 23.79,43.41 arc90 24.17,43.79 24.17,43.8 arc90 23.79,44.18 22.5,44.18 arc-90 22.12,44.56 22.12,44.57 arc-90 22.5,44.95 23.79,44.95 arc90 24.17,45.33 24.17,45.34 arc90 23.79,45.72 22.5,45.72 arc-90 22.12,46.1 RJ1.TD+
TXD
  Top 0.254: IC5.32 52.44,23.12 53.16,22.4 JP3.2
VBUS
  Top 0.254: IC1.5 63.5,17.28 64.41,17.28 64.69,16.99 64.69,15.22
  Top 0.279: IC5.34 55.68,27.61 57.51,25.78 57.51,18.69 60.98,15.22 64.69,15.22 66.19,15.22 X3.1
  Top 0.305: C5.+ 70.64,23.16
  Top 0.406: C12.+ 52.58,59.99 52.7,60.12 | SG1.+
  Top 0.813: 70.64,23.16 70.64,13.95 C27.1 X3.1 | C5.+ 70.64,60.12 SG1.+ 52.7,60.12 F1.2 49.54,60.13 47.04,60.13 | IC2.3 47.04,60.13 | 47.04,60.13 C13.1
VCAP
  Top 0.279: IC5.56 48.94,43.64 C9.1